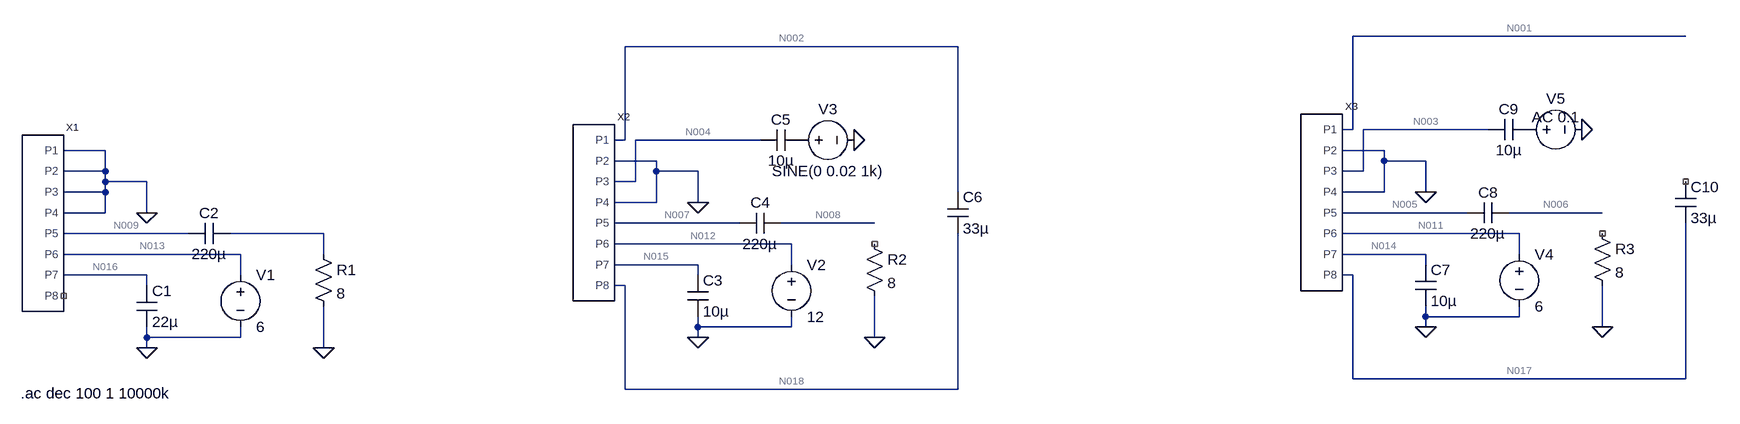
[diagram p0: schematic Draft7.asc]
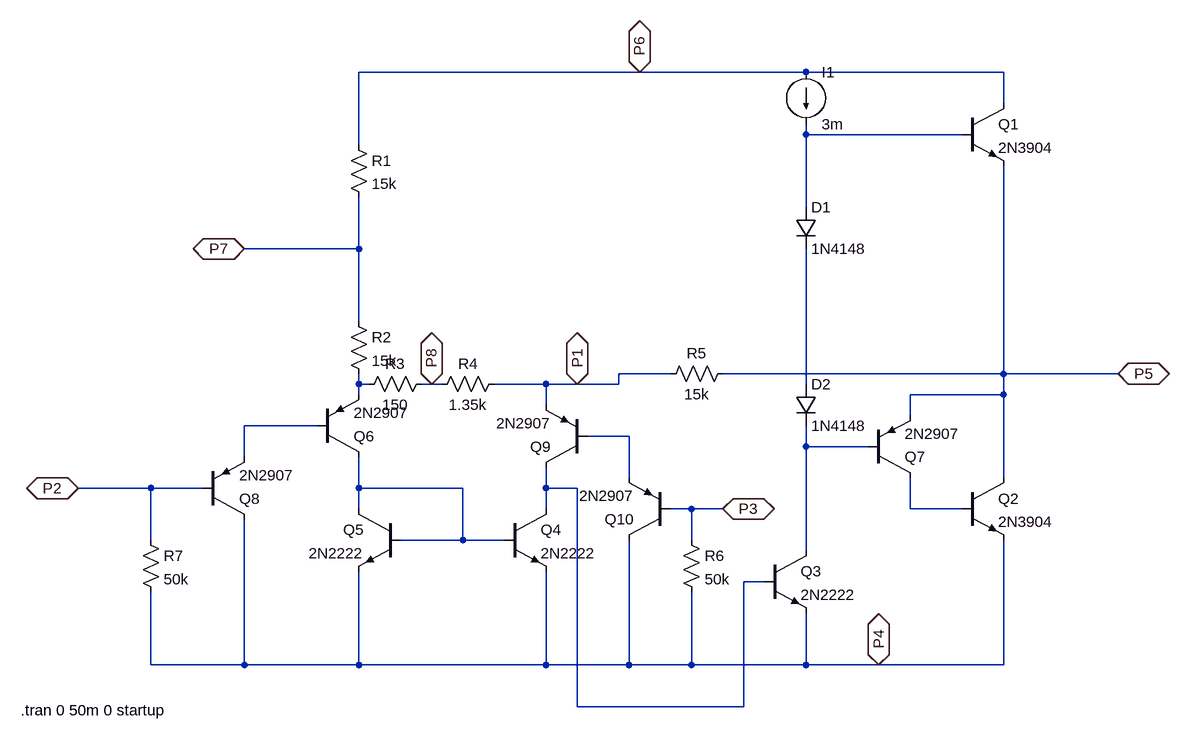
[diagram p1: sub-circuit 3_27.asc]
Draft7.asc, the LTspice schematic file:
Version 4
SHEET 1 2600 680
WIRE 2544 -144 2032 -144
WIRE 1424 -128 912 -128
WIRE 2032 0 2032 -144
WIRE 2032 0 2016 0
WIRE 2240 0 2048 0
WIRE 912 16 912 -128
WIRE 912 16 896 16
WIRE 1120 16 928 16
WIRE 112 32 48 32
WIRE 2080 32 2016 32
WIRE 960 48 896 48
WIRE 2080 48 2080 32
WIRE 2144 48 2080 48
WIRE 112 64 112 32
WIRE 112 64 48 64
WIRE 960 64 960 48
WIRE 1024 64 960 64
WIRE 2048 64 2048 0
WIRE 2048 64 2016 64
WIRE 112 80 112 64
WIRE 176 80 112 80
WIRE 928 80 928 16
WIRE 928 80 896 80
WIRE 112 96 112 80
WIRE 112 96 48 96
WIRE 1424 96 1424 -128
WIRE 2080 96 2080 48
WIRE 2080 96 2016 96
WIRE 2144 96 2144 48
WIRE 960 112 960 64
WIRE 960 112 896 112
WIRE 1024 112 1024 64
WIRE 112 128 112 96
WIRE 112 128 48 128
WIRE 176 128 176 80
WIRE 2208 128 2016 128
WIRE 2416 128 2272 128
WIRE 1088 144 896 144
WIRE 1296 144 1152 144
WIRE 240 160 48 160
WIRE 448 160 304 160
WIRE 2288 160 2016 160
WIRE 1168 176 896 176
WIRE 320 192 48 192
WIRE 448 192 448 160
WIRE 2144 192 2016 192
WIRE 2288 192 2288 160
WIRE 1024 208 896 208
WIRE 1168 208 1168 176
WIRE 2144 208 2144 192
WIRE 176 224 48 224
WIRE 320 224 320 192
WIRE 1024 224 1024 208
WIRE 2032 224 2016 224
WIRE 176 240 176 224
WIRE 912 240 896 240
WIRE 2144 288 2144 272
WIRE 2288 288 2288 272
WIRE 2288 288 2144 288
WIRE 1024 304 1024 288
WIRE 1168 304 1168 288
WIRE 1168 304 1024 304
WIRE 2144 304 2144 288
WIRE 2416 304 2416 240
WIRE 176 320 176 304
WIRE 320 320 320 304
WIRE 320 320 176 320
WIRE 1024 320 1024 304
WIRE 1296 320 1296 256
WIRE 176 336 176 320
WIRE 448 336 448 272
WIRE 2032 384 2032 224
WIRE 2544 384 2544 144
WIRE 2544 384 2032 384
WIRE 912 400 912 240
WIRE 1424 400 1424 160
WIRE 1424 400 912 400
FLAG 176 336 0
FLAG 448 336 0
FLAG 176 128 0
FLAG 1024 320 0
FLAG 1296 320 0
FLAG 1024 112 0
FLAG 1264 16 0
FLAG 2144 304 0
FLAG 2416 304 0
FLAG 2144 96 0
FLAG 2384 0 0
SYMBOL 3_27 16 144 R0
SYMATTR InstName X1
SYMBOL cap 160 240 R0
SYMATTR InstName C1
SYMATTR Value 22µ
SYMBOL voltage 320 208 R0
WINDOW 123 0 0 Left 0
WINDOW 39 0 0 Left 0
SYMATTR InstName V1
SYMATTR Value 6
SYMBOL cap 304 144 R90
WINDOW 0 0 32 VBottom 2
WINDOW 3 32 32 VTop 2
SYMATTR InstName C2
SYMATTR Value 220µ
SYMBOL res 432 176 R0
SYMATTR InstName R1
SYMATTR Value 8
SYMBOL 3_27 864 128 R0
SYMATTR InstName X2
SYMBOL cap 1008 224 R0
SYMATTR InstName C3
SYMATTR Value 10µ
SYMBOL voltage 1168 192 R0
WINDOW 123 0 0 Left 0
WINDOW 39 0 0 Left 0
SYMATTR InstName V2
SYMATTR Value 12
SYMBOL cap 1152 128 R90
WINDOW 0 0 32 VBottom 2
WINDOW 3 32 32 VTop 2
SYMATTR InstName C4
SYMATTR Value 220µ
SYMBOL res 1280 160 R0
SYMATTR InstName R2
SYMATTR Value 8
SYMBOL cap 1184 0 R90
WINDOW 0 0 32 VBottom 2
WINDOW 3 32 32 VTop 2
SYMATTR InstName C5
SYMATTR Value 10µ
SYMBOL voltage 1168 16 R270
WINDOW 0 32 56 VTop 2
WINDOW 3 -32 56 VBottom 2
WINDOW 123 0 0 Left 0
WINDOW 39 0 0 Left 0
SYMATTR InstName V3
SYMATTR Value SINE(0 0.02 1k)
SYMBOL cap 1408 96 R0
SYMATTR InstName C6
SYMATTR Value 33µ
SYMBOL 3_27 1984 112 R0
SYMATTR InstName X3
SYMBOL cap 2128 208 R0
SYMATTR InstName C7
SYMATTR Value 10µ
SYMBOL voltage 2288 176 R0
WINDOW 123 0 0 Left 0
WINDOW 39 0 0 Left 0
SYMATTR InstName V4
SYMATTR Value 6
SYMBOL cap 2272 112 R90
WINDOW 0 0 32 VBottom 2
WINDOW 3 32 32 VTop 2
SYMATTR InstName C8
SYMATTR Value 220µ
SYMBOL res 2400 144 R0
SYMATTR InstName R3
SYMATTR Value 8
SYMBOL cap 2304 -16 R90
WINDOW 0 0 32 VBottom 2
WINDOW 3 32 32 VTop 2
SYMATTR InstName C9
SYMATTR Value 10µ
SYMBOL voltage 2288 0 R270
WINDOW 0 32 56 VTop 2
WINDOW 3 -32 56 VBottom 2
WINDOW 123 4 56 VTop 2
WINDOW 39 0 0 Left 0
SYMATTR InstName V5
SYMATTR Value ""
SYMATTR Value2 AC 0.1
SYMBOL cap 2528 80 R0
SYMATTR InstName C10
SYMATTR Value 33µ
TEXT -18 406 Left 2 !.ac dec 100 1 10000k

3_27.asc, the sub-circuit schematic file:
Version 4
SHEET 1 5944 792
WIRE 592 -208 160 -208
WIRE 848 -208 592 -208
WIRE 1152 -208 848 -208
WIRE 1152 -160 1152 -208
WIRE 848 -112 848 -128
WIRE 1088 -112 848 -112
WIRE 160 -96 160 -208
WIRE 848 0 848 -112
WIRE 160 64 160 -16
WIRE 160 64 -16 64
WIRE 160 176 160 64
WIRE 640 256 560 256
WIRE 1152 256 1152 -64
WIRE 1152 256 720 256
WIRE 1328 256 1152 256
WIRE 160 272 160 256
WIRE 176 272 160 272
WIRE 272 272 256 272
WIRE 288 272 272 272
WIRE 448 272 368 272
WIRE 496 272 448 272
WIRE 560 272 560 256
WIRE 560 272 496 272
WIRE 848 272 848 64
WIRE 160 288 160 272
WIRE 1152 288 1152 256
WIRE 1152 288 1008 288
WIRE 448 304 448 272
WIRE 1008 320 1008 288
WIRE 96 336 -16 336
WIRE 576 352 512 352
WIRE 848 368 848 336
WIRE 944 368 848 368
WIRE -16 384 -16 336
WIRE 576 416 576 352
WIRE 1152 416 1152 288
WIRE -160 432 -272 432
WIRE -80 432 -160 432
WIRE 160 432 160 384
WIRE 320 432 160 432
WIRE 448 432 448 400
WIRE 496 432 448 432
WIRE 160 464 160 432
WIRE 448 464 448 432
WIRE 672 464 640 464
WIRE 720 464 672 464
WIRE 1008 464 1008 416
WIRE 1088 464 1008 464
WIRE -160 512 -160 432
WIRE 320 512 320 432
WIRE 320 512 224 512
WIRE 384 512 320 512
WIRE 672 512 672 464
WIRE 848 528 848 368
WIRE 784 576 752 576
WIRE -160 704 -160 592
WIRE -16 704 -16 480
WIRE -16 704 -160 704
WIRE 160 704 160 560
WIRE 160 704 -16 704
WIRE 448 704 448 560
WIRE 448 704 160 704
WIRE 576 704 576 512
WIRE 576 704 448 704
WIRE 672 704 672 592
WIRE 672 704 576 704
WIRE 848 704 848 624
WIRE 848 704 672 704
WIRE 960 704 848 704
WIRE 1152 704 1152 512
WIRE 1152 704 960 704
WIRE 496 768 496 432
WIRE 752 768 752 576
WIRE 752 768 496 768
FLAG -16 64 P7
IOPIN -16 64 BiDir
FLAG 496 272 P1
IOPIN 496 272 BiDir
FLAG 272 272 P8
IOPIN 272 272 BiDir
FLAG 592 -208 P6
IOPIN 592 -208 BiDir
FLAG 1328 256 P5
IOPIN 1328 256 BiDir
FLAG 960 704 P4
IOPIN 960 704 BiDir
FLAG -272 432 P2
IOPIN -272 432 BiDir
FLAG 720 464 P3
IOPIN 720 464 BiDir
SYMBOL res 144 -112 R0
SYMATTR InstName R1
SYMATTR Value 15k
SYMBOL res 144 160 R0
SYMATTR InstName R2
SYMATTR Value 15k
SYMBOL res 272 256 R90
WINDOW 0 0 56 VBottom 2
WINDOW 3 32 56 VTop 2
SYMATTR InstName R3
SYMATTR Value 150
SYMBOL res 384 256 R90
WINDOW 0 0 56 VBottom 2
WINDOW 3 32 56 VTop 2
SYMATTR InstName R4
SYMATTR Value 1.35k
SYMBOL res 736 240 R90
WINDOW 0 0 56 VBottom 2
WINDOW 3 32 56 VTop 2
SYMATTR InstName R5
SYMATTR Value 15k
SYMBOL diode 832 0 R0
SYMATTR InstName D1
SYMATTR Value 1N4148
SYMBOL diode 832 272 R0
SYMATTR InstName D2
SYMATTR Value 1N4148
SYMBOL current 848 -208 R0
WINDOW 123 0 0 Left 0
WINDOW 39 0 0 Left 0
SYMATTR InstName I1
SYMATTR Value 3m
SYMBOL npn 1088 -160 R0
SYMATTR InstName Q1
SYMATTR Value 2N3904
SYMBOL npn 1088 416 R0
SYMATTR InstName Q2
SYMATTR Value 2N3904
SYMBOL npn 784 528 R0
SYMATTR InstName Q3
SYMATTR Value 2N2222
SYMBOL npn 384 464 R0
SYMATTR InstName Q4
SYMATTR Value 2N2222
SYMBOL npn 224 464 M0
SYMATTR InstName Q5
SYMATTR Value 2N2222
SYMBOL pnp 96 384 M180
SYMATTR InstName Q6
SYMATTR Value 2N2907
SYMBOL pnp 944 416 M180
SYMATTR InstName Q7
SYMATTR Value 2N2907
SYMBOL pnp -80 480 M180
SYMATTR InstName Q8
SYMATTR Value 2N2907
SYMBOL pnp 512 400 R180
SYMATTR InstName Q9
SYMATTR Value 2N2907
SYMBOL pnp 640 512 R180
SYMATTR InstName Q10
SYMATTR Value 2N2907
SYMBOL res 656 496 R0
SYMATTR InstName R6
SYMATTR Value 50k
SYMBOL res -176 496 R0
SYMATTR InstName R7
SYMATTR Value 50k
TEXT -360 774 Left 2 !.tran 0 50m 0 startup

The netlist it stands for:
* Draft7.asc
XX1 0 0 0 0 N009 N013 N016 NC_01 3_27
C1 N016 0 22µ
V1 N013 0 6
C2 N010 N009 220µ
R1 N010 0 8
XX2 N002 0 N004 0 N007 N012 N015 N018 3_27
C3 N015 0 10µ
V2 N012 0 12
C4 N008 N007 220µ
R2 NC_02 0 8
C5 P001 N004 10µ
V3 P001 0 SINE(0 0.02 1k)
C6 N002 N018 33µ
XX3 N001 0 N003 0 N005 N011 N014 N017 3_27
C7 N014 0 10µ
V4 N011 0 6
C8 N006 N005 220µ
R3 NC_03 0 8
C9 P002 N003 10µ
V5 P002 0 AC 0.1
C10 NC_04 N017 33µ

* block symbol definitions
.subckt 3_27 P1 P2 P3 P4 P5 P6 P7 P8
R1 P6 P7 15k
R2 P7 N002 15k
R3 P8 N002 150
R4 P1 P8 1.35k
R5 P5 P1 15k
D1 N001 N003 1N4148
D2 N003 N006 1N4148
I1 P6 N001 3m
Q1 P6 N001 P5 0 2N3904
Q2 P5 N009 P4 0 2N3904
Q3 N006 N008 P4 0 2N2222
Q4 N008 N007 P4 0 2N2222
Q5 N007 N007 P4 0 2N2222
Q6 N007 N004 N002 0 2N2907
Q7 N009 N006 P5 0 2N2907
Q8 P4 P2 N004 0 2N2907
Q9 N008 N005 P1 0 2N2907
Q10 P4 P3 N005 0 2N2907
R6 P3 P4 50k
R7 P2 P4 50k
.tran 0 50m 0 startup
.ends 3_27

.model D D
.lib standard.dio
.model NPN NPN
.model PNP PNP
.lib standard.bjt
.ac dec 100 1 10000k
.backanno
.end

* Results of the author's LTspice run, read from the files saved beside the schematic
* Operating Point, zero values left out:
*   V(n013) = 6 V
*   V(n016) = 3.143 V
*   V(n009) = 5.999 V
*   V(n012) = 12 V
*   V(n015) = 6.558 V
*   V(n018) = 1.115 V
*   V(n002) = 1.117 V
*   V(n007) = 6.759 V
*   V(n004) = 298.4 µV
*   V(n008) = 1.487 mV
*   V(n011) = 6 V
*   V(n014) = 3.537 V
*   V(n017) = 1.075 V
*   V(n001) = 1.079 V
*   V(n005) = 3.821 V
*   V(n003) = 143.3 µV
*   V(n006) = 840.4 µV
*   I(V4) = -11.19 mA
*   I(V2) = -11.8 mA
*   I(V1) = -590.4 µA
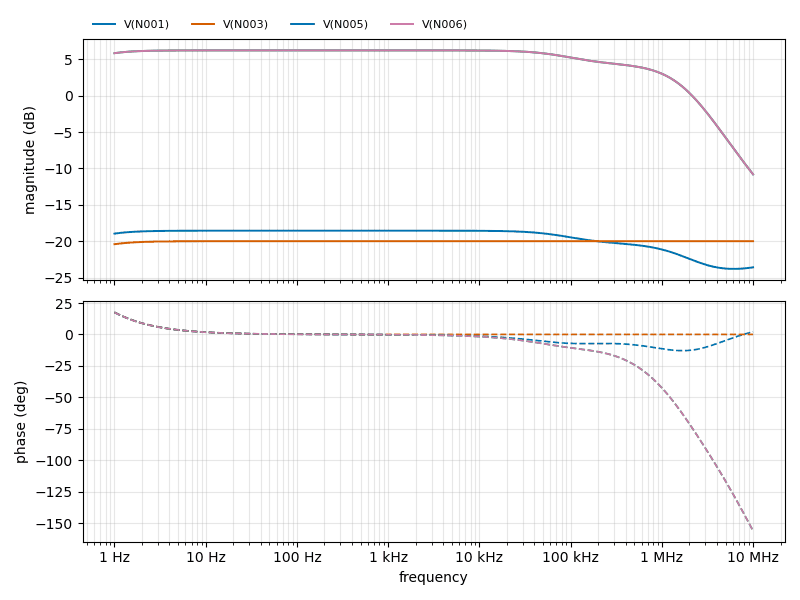
[diagram p2: AC Analysis of Draft7.asc, plotted from the saved traces]
* AC Analysis, 1 run:
*   V(N001): -18.96 dB at 1 Hz, -23.59 dB at 10 MHz, peak -18.55 dB at 213.8 Hz, 3 dB below the peak at 1.306 MHz
*   V(N003): -20.42 dB at 1 Hz, -20.00 dB at 10 MHz, peak -20.00 dB at 4.677 kHz
*   V(N005): 5.84 dB at 1 Hz, -10.81 dB at 10 MHz, peak 6.23 dB at 190.5 Hz, 3 dB below the peak at 914.6 kHz
*   V(N006): 5.84 dB at 1 Hz, -10.81 dB at 10 MHz, peak 6.23 dB at 190.5 Hz, 3 dB below the peak at 914.6 kHz